# EAGLE design TeklaShieldThroughHole (EAGLE 5.10)
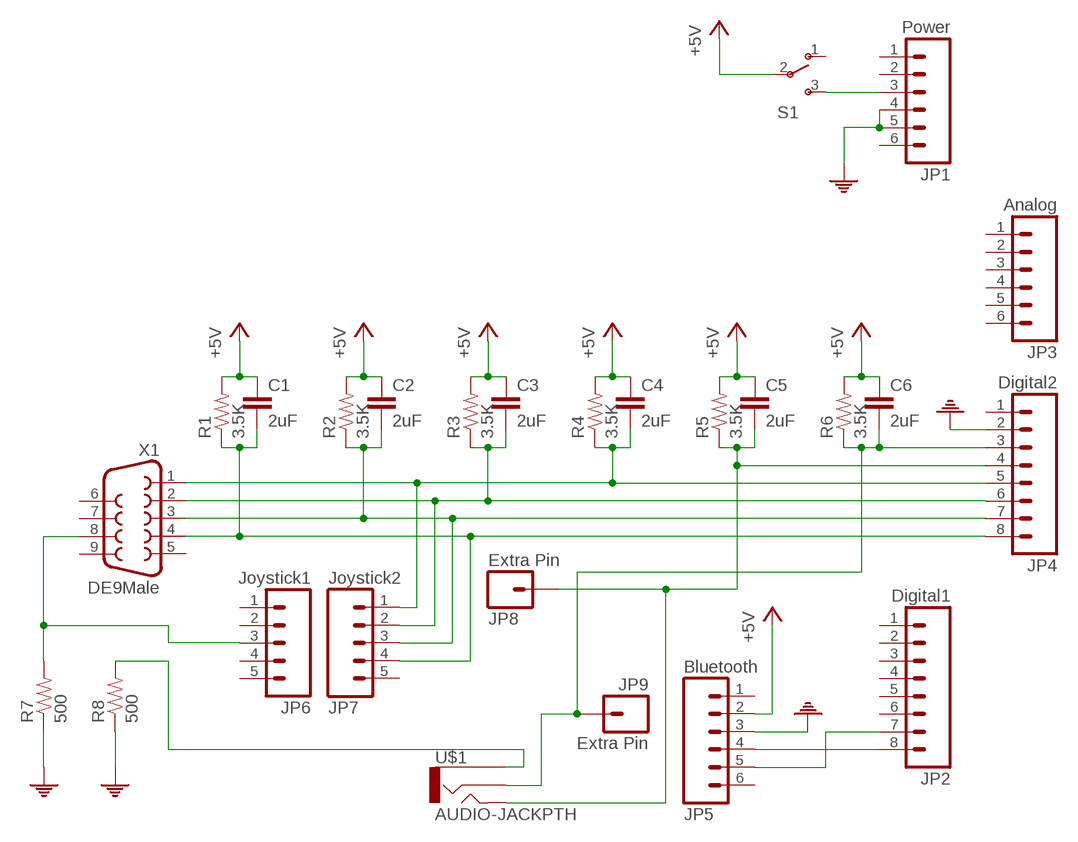
[diagram p0: schematic, sheet 1]

## Parts
C1  2uF  CAPPTH  [CAP-PTH-SMALL]
C2  2uF  CAPPTH  [CAP-PTH-SMALL]
C3  2uF  CAPPTH  [CAP-PTH-SMALL]
C4  2uF  CAPPTH  [CAP-PTH-SMALL]
C5  2uF  CAPPTH  [CAP-PTH-SMALL]
C6  2uF  CAPPTH  [CAP-PTH-SMALL]
JP1  Power  M06SIP  [1X06]
JP2  Digital1  M08  [1X08]
JP3  Analog  M06SIP  [1X06]
JP4  Digital2  M08  [1X08]
JP5  Bluetooth  M06SIP  [1X06]
JP6  Joystick1  M05  [1X05]
JP7  Joystick2  M05  [1X05]
JP8  Extra Pin  M01PTH  [1X01]
JP9  Extra Pin  M01PTH  [1X01]
R1  3.5K  RESISTORPTH1  [AXIAL-0.3]
R2  3.5K  RESISTORPTH1  [AXIAL-0.3]
R3  3.5K  RESISTORPTH1  [AXIAL-0.3]
R4  3.5K  RESISTORPTH1  [AXIAL-0.3]
R5  3.5K  RESISTORPTH1  [AXIAL-0.3]
R6  3.5K  RESISTORPTH1  [AXIAL-0.3]
R7  500  RESISTORPTH1  [AXIAL-0.3]
R8  500  RESISTORPTH1  [AXIAL-0.3]
S1  SWITCH-SPST  [SWITCH-SPST]
U$1  AUDIO-JACKPTH  [AUDIO-JACK]
X1  DE9Male  DB9  [DB9]

## Nets
E1: C5.2 JP4.4 JP8.1 R5.P$1 U$1.5
E2: C6.2 JP4.3 JP9.1 R6.P$1 U$1.2
ECMN: R8.P$2 U$1.1
GND: JP1.4 JP1.5 JP4.2 JP5.3 R7.P$1 R8.P$1
JCMN: JP6.3 R7.P$2 X1.8
N$1: JP2.8 JP5.4
N$2: JP2.7 JP5.5
N$3: JP1.3 S1.3(S)
S1: C4.2 JP4.5 JP7.1 R4.P$1 X1.1
S2: C3.2 JP4.6 JP7.2 R3.P$1 X1.2
S3: C2.2 JP4.7 JP7.3 R2.P$1 X1.3
S4: C1.2 JP4.8 JP7.4 R1.P$1 X1.4
VCC: C1.1 C2.1 C3.1 C4.1 C5.1 C6.1 JP5.2 R1.P$2 R2.P$2 R3.P$2 R4.P$2 R5.P$2 R6.P$2 S1.2(P) ; supply symbol labelled +5V
Unconnected: JP1.1 JP1.2 JP1.6 JP2.1 JP2.2 JP2.3 JP2.4 JP2.5 JP2.6 JP3.1 JP3.2 JP3.3 JP3.4 JP3.5 JP3.6 JP4.1 JP5.1 JP5.6 JP6.1 JP6.2 JP6.4 JP6.5 JP7.5 S1.1(O) X1.5 X1.6 X1.7 X1.9

## Library data of the parts
C1-C6 = SparkFun-3-2-07:CAP: Capacitor Standard 0603 ceramic capacitor, and 0.1" leaded capacitor.
JP1 JP3 JP5 = SparkFun-3-2-07:M06: Header 6 Standard 6-pin 0.1" header. Use with straight break away headers (SKU : PType-HD), right angle break away headers (PType-HD-RightAngle), swiss pins (PType-30F), machine pins (PType-MP), and female headers (PType-FH). Molex polarized connector foot print use with SKU : Con-Hdr with associated crimp pins and housings.
JP2 JP4 = SparkFun-3-2-07:M08: Header 8 Standard 8-pin 0.1" header. Use with straight break away headers (SKU : PType-HD), right angle break away headers (PType-HD-RightAngle), swiss pins (PType-30F), machine pins (PType-MP), and female headers (PType-FH). Molex polarized connector foot print use with SKU : Con-Hdr with associated crimp pins and housings.
JP6 JP7 = SparkFun-3-2-07:M05: Header 5 Standard 5-pin 0.1" header. Use with straight break away headers (SKU : PType-HD), right angle break away headers (PType-HD-RightAngle), swiss pins (PType-30F), machine pins (PType-MP), and female headers (PType-FH). Molex polarized connector foot print use with SKU : Con-Hdr with associated crimp pins and housings.
JP8 JP9 = SparkFun:M01: Header 1 Standard 1-pin 0.1" header. Use with straight break away headers (SKU : PRT-00116), right angle break away headers (PRT-00553), swiss pins (PRT-00743), machine pins (PRT-00117), and female headers (PRT-00115).
R1-R8 = SparkFun-3-2-07:RESISTOR: Resistor Basic schematic elements and footprints for 0603, 1206, and PTH 1/10th watt (small) resistors.
S1 = SparkFun-3-2-07:SWITCH-SPST: SPST Switch Simple slide switch. Spark Fun Electronics SKU : Comp-SW1
U$1 = SparkFun:AUDIO-JACK: 3.5mm Audio Jack Simple 3.5mm common PCB mount audio jack. SKU: PRT-08032
X1 = SparkFun-3-2-07:DB9: DB9 Connector Standard DB9 (D-Sub 9) serial connector. Can be used for CAN bus as well as RS485 and RS232. Footprint production proven. Spark Fun Electronics SKU : PType-DB9-PCB

## Board
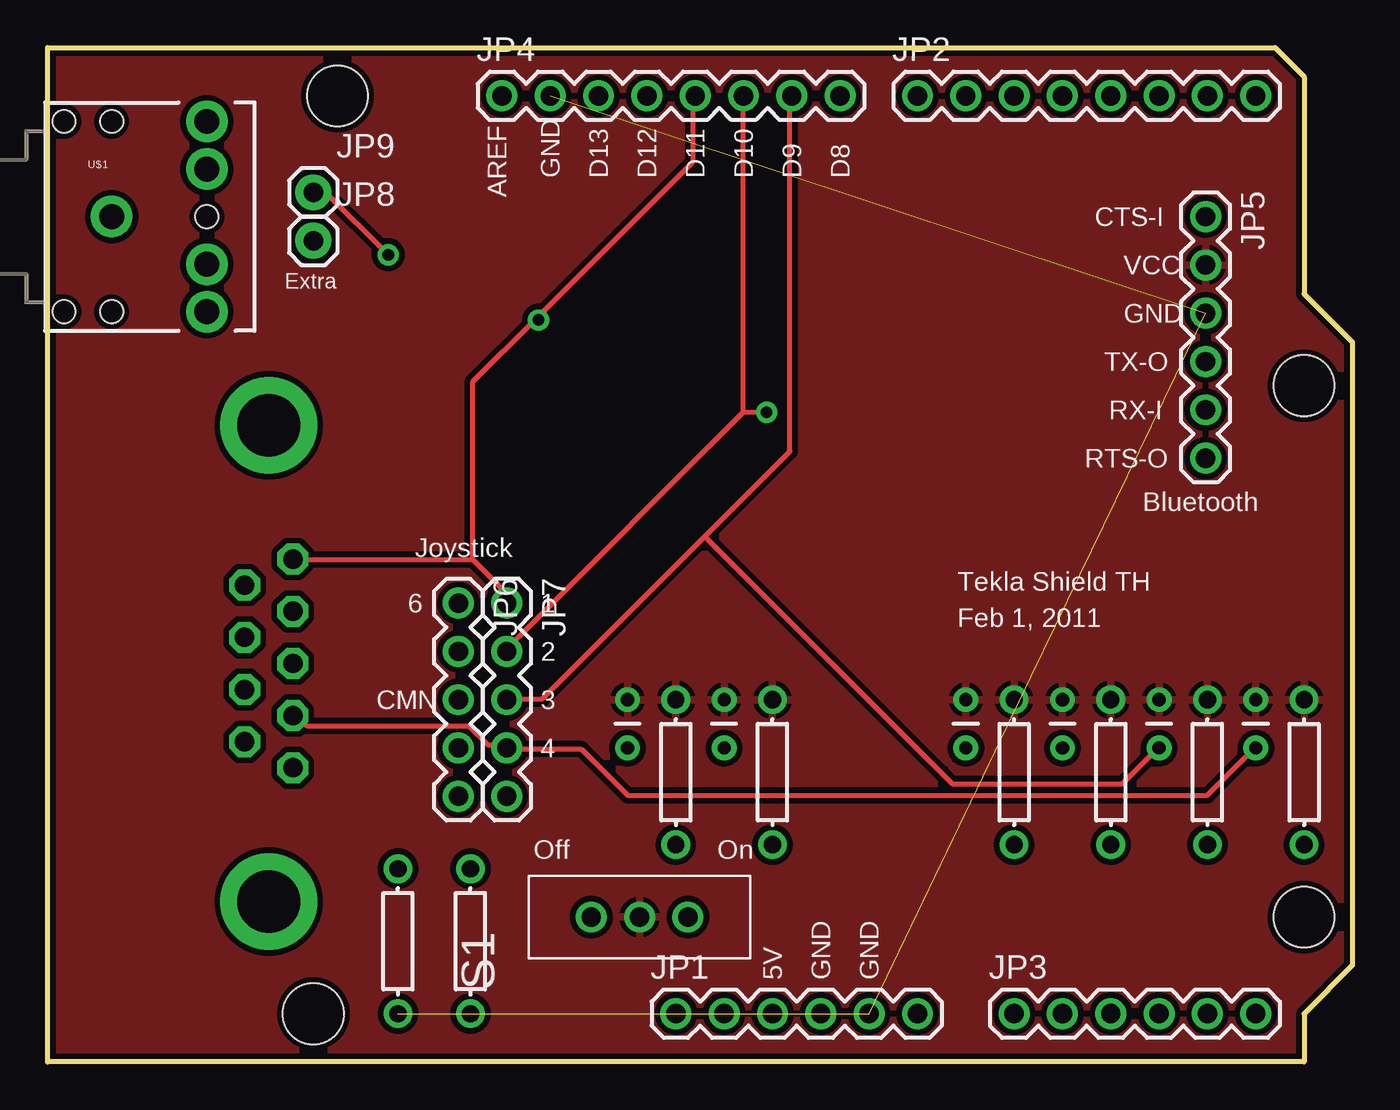
[diagram p1: board, top side]
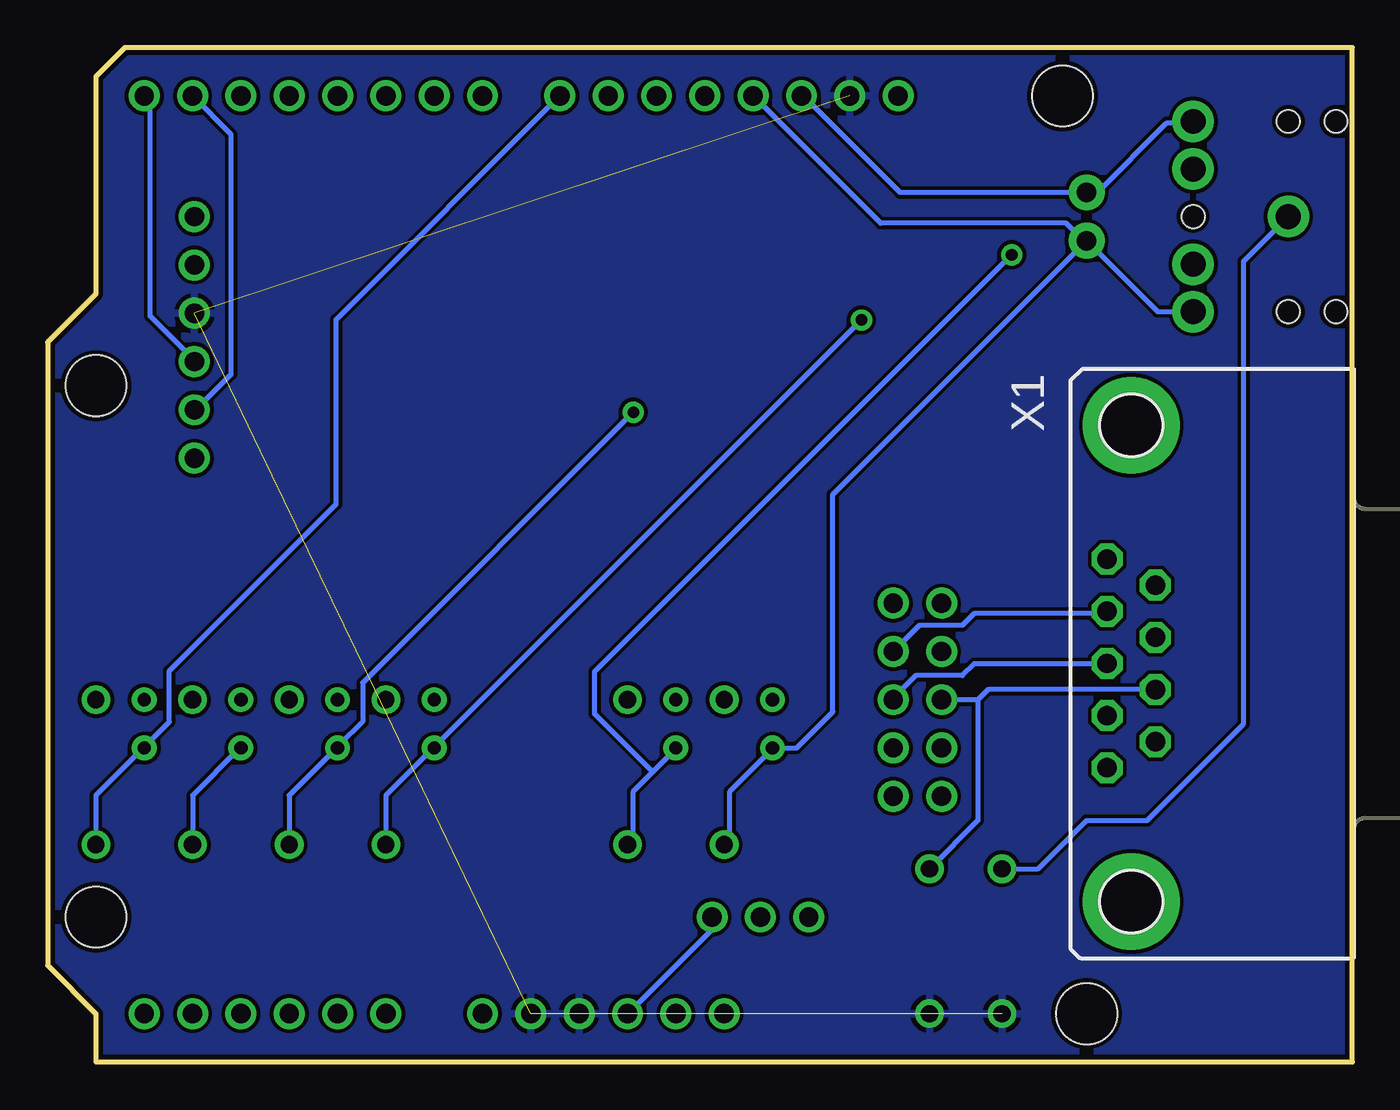
[diagram p2: board, bottom side, seen from below]

Size 68.58 x 53.34 mm. Coordinates in mm from the lower left corner, seen from the top.
Outline: 0,53.34 64.52,53.34 66.04,51.82 66.04,40.39 68.58,37.85 68.58,5.08 66.04,2.54 66.04,0 0,0 0,53.34
Copper layers (1*16): Top 0.035mm / dielectric 1.5mm / Bottom 0.035mm
Design rules "SparkFun": minimum track width 8mil, minimum drill 20mil, track to track 8mil, track to pad 8mil, pad to pad 8mil, via to via 8mil, smd to smd 8mil, copper to edge 10mil, drill to drill 8mil, minimum pad ring 12mil, minimum via ring 10mil, stop-mask expansion 4mil, vias tented up to drill 25mil, thermal gap 10mil
Holes 3.2 mm at 66.04,35.56 66.04,7.62 15.24,50.8 13.97,2.54

### Footprints (pad centres in the part's own frame; a part is rotated, then mirrored left to right if it is on the bottom)
CAP-PTH-SMALL = drill 0.7 round: 1 0,0; 2 2.54,0
1X06 = drill 1.016 round: 1 0,0; 2 2.54,0; 3 5.08,0; 4 7.62,0; 5 10.16,0; 6 12.7,0
1X08 = drill 1.016 round: 1 0,0; 2 2.54,0; 3 5.08,0; 4 7.62,0; 5 10.16,0; 6 12.7,0; 7 15.24,0; 8 17.78,0
1X05 = drill 1.016 round: 1 0,0; 2 2.54,0; 3 5.08,0; 4 7.62,0; 5 10.16,0
1X01 = drill 1.016 pad 1.88 round: 1 0,0
AXIAL-0.3 = drill 0.9 round: P$1 -3.81,0; P$2 3.81,0
SWITCH-SPST = drill 1.016 round: 1 0,2.54; 2 0,0; 3 0,-2.54
AUDIO-JACK = drill 1.3 pad 2.184 round: 1 0,0; 2 5,5; 3 5,2.5; 4 5,-2.5; 5 5,-5 | hole 1.2: 0,5; -2.5,5; -2.5,-5; 0,-5; 5,0
DB9 = drill 1.016 octagon: 1 -5.486,-1.27; 2 -2.743,-1.27; 3 0,-1.27; 4 2.743,-1.27; 5 5.486,-1.27; 6 -4.115,1.27; 7 -1.372,1.27; 8 1.372,1.27; 9 4.115,1.27 | drill 3.302 pad 5.08 round: G1 -12.522,0; G2 12.522,0

### Placement (x,y rotation side)
C1  63.5,19.05 270 top
C2  58.42,19.05 270 top
C3  53.34,19.05 270 top
C4  48.26,19.05 270 top
C5  30.48,19.05 270 top
C6  35.56,19.05 270 top
JP1  33.02,2.54 0 top
JP2  45.72,50.8 0 top
JP3  50.8,2.54 0 top
JP4  23.88,50.8 0 top
JP5  60.87,44.45 270 top
JP6  21.59,24.13 270 top
JP7  24.13,24.13 270 top
JP8  13.97,43.18 0 top
JP9  13.97,45.72 0 top
R1  66.04,15.24 90 top
R2  60.96,15.24 90 top
R3  55.88,15.24 90 top
R4  50.8,15.24 90 top
R5  33.02,15.24 90 top
R6  38.1,15.24 90 top
R7  22.23,6.35 90 top
R8  18.41,6.35 90 top
S1  31.11,7.62 90 top
U$1  3.37,44.45 0 top
X1  11.62,20.95 270 bottom

### Tracks (layer width: path | path; a pad name or v marks a point on that pad's centre or on a via)
E1
  Bottom 0.254: R5.P$1 32.92,11.58 32.72,11.79 32.72,14.22 30.48,16.46 C5.2 29.21,16.51 27.3,18.41 27.3,29.84 JP8.1 | JP4.4 24.79,44.09 15.04,44.09 14.02,43.08 JP8.1 | U$1.5 10.24,39.45 JP8.1
E2  (via drill 0.61)
  Top 0.254: v17.91,42.44 14.63,45.72 JP9.1
  Bottom 0.254: 36.78,15.24 37.8,14.22 37.8,11.79 38,11.58 R6.P$1 | 36.78,15.24 35.56,16.46 C6.2 | JP4.3 28.85,50.8 23.77,45.72 JP9.1 13.41,45.72 9.75,49.38 8.53,49.38 U$1.2 | 36.78,15.24 39.83,18.29 39.83,20.52 v17.91,42.44
ECMN
  Bottom 0.254: R8.P$2 16.51,10.16 13.97,12.7 10.79,12.7 5.71,17.78 5.71,42.1 U$1.1
GND  (5 unrouted)
  pour Bottom: 0,53.34 68.58,53.34 68.58,0 0,0
JCMN
  Bottom 0.254: X1.8 19.15,19.58 19.68,19.05 | 19.68,19.05 JP6.3 | R7.P$2 19.68,12.7 19.68,19.05
N$1
  Bottom 0.254: JP5.4 60.96,36.98 63.2,39.22 63.2,50.6 63.4,50.8 JP2.8
N$2
  Bottom 0.254: JP2.7 58.93,48.77 58.93,36.17 60.76,34.34 JP5.5
N$3
  Bottom 0.254: JP1.3 33.73,6.91 33.73,7.52 S1.3
S1  (via drill 0.61)
  Top 0.254: 22.35,26.42 13.01,26.42 X1.1 | 22.35,26.42 23.98,24.79 23.98,24.18 JP7.1 | 25.6,39.01 22.35,35.76 22.35,26.42 | 25.6,39.01 33.93,47.35 33.93,50.8 JP4.5 | 25.6,39.01 v25.81,39.01
  Bottom 0.254: R4.P$1 50.8,14.02 48.36,16.46 C4.2 48.16,16.66 v25.81,39.01
S2  (via drill 0.61)
  Top 0.254: 36.58,34.16 JP4.6 | 36.58,34.16 24.79,22.38 24.18,21.74 JP7.2 | 36.58,34.16 v37.8,34.16
  Bottom 0.254: R3.P$1 55.88,14.02 53.44,16.46 C3.2 53.24,16.66 52.02,17.88 52.02,19.94 v37.8,34.16 | X1.2 13.01,23.57 19.89,23.57 20.5,22.96 22.76,22.96 JP7.2
S3
  Top 0.254: 34.54,27.64 26.01,19.1 24.18,19.1 JP7.3 | 34.54,27.64 39.01,32.11 39.01,50.8 JP4.7 | 34.54,27.64 47.55,14.63 56.49,14.63 58.32,16.46 C2.2
  Bottom 0.254: C2.2 58.52,16.46 60.96,14.02 R2.P$1 | X1.3 13.01,20.93 19.89,20.93 20.5,20.32 22.96,20.32 24.18,19.1 JP7.3
S4
  Top 0.254: X1.4 13.01,18.29 13.61,17.68 22.15,17.68 23.16,16.66 23.98,16.66 JP7.4 24.18,16.46 28.04,16.46 30.48,14.02 60.96,14.02 63.4,16.46 C1.2
  Bottom 0.254: R1.P$1 66.04,14.02 63.6,16.46 C1.2 63.4,16.66 62.18,17.88 62.18,20.57 53.42,29.34 53.42,39.04 JP4.8
VCC
  pour Top (isolate 0.305): 0,53.34 68.58,53.34 68.58,0 0,0

### Text on the board
tPlace: GND | D13 | D12 | D11 | D10 | D9 | D8 | AREF | CTS-I | Extra | VCC | GND | TX-O | RX-I | RTS-O | Bluetooth | Joystick | Tekla Shield TH | 6 | 1 | Feb 1, 2011 | 2 | CMN | 3 | 4 | Off | On | 5V | GND | GND